# EAGLE schematic arduino board (EAGLE 6.1)

## Sheet 1 of 3: ANALOG COMMAND
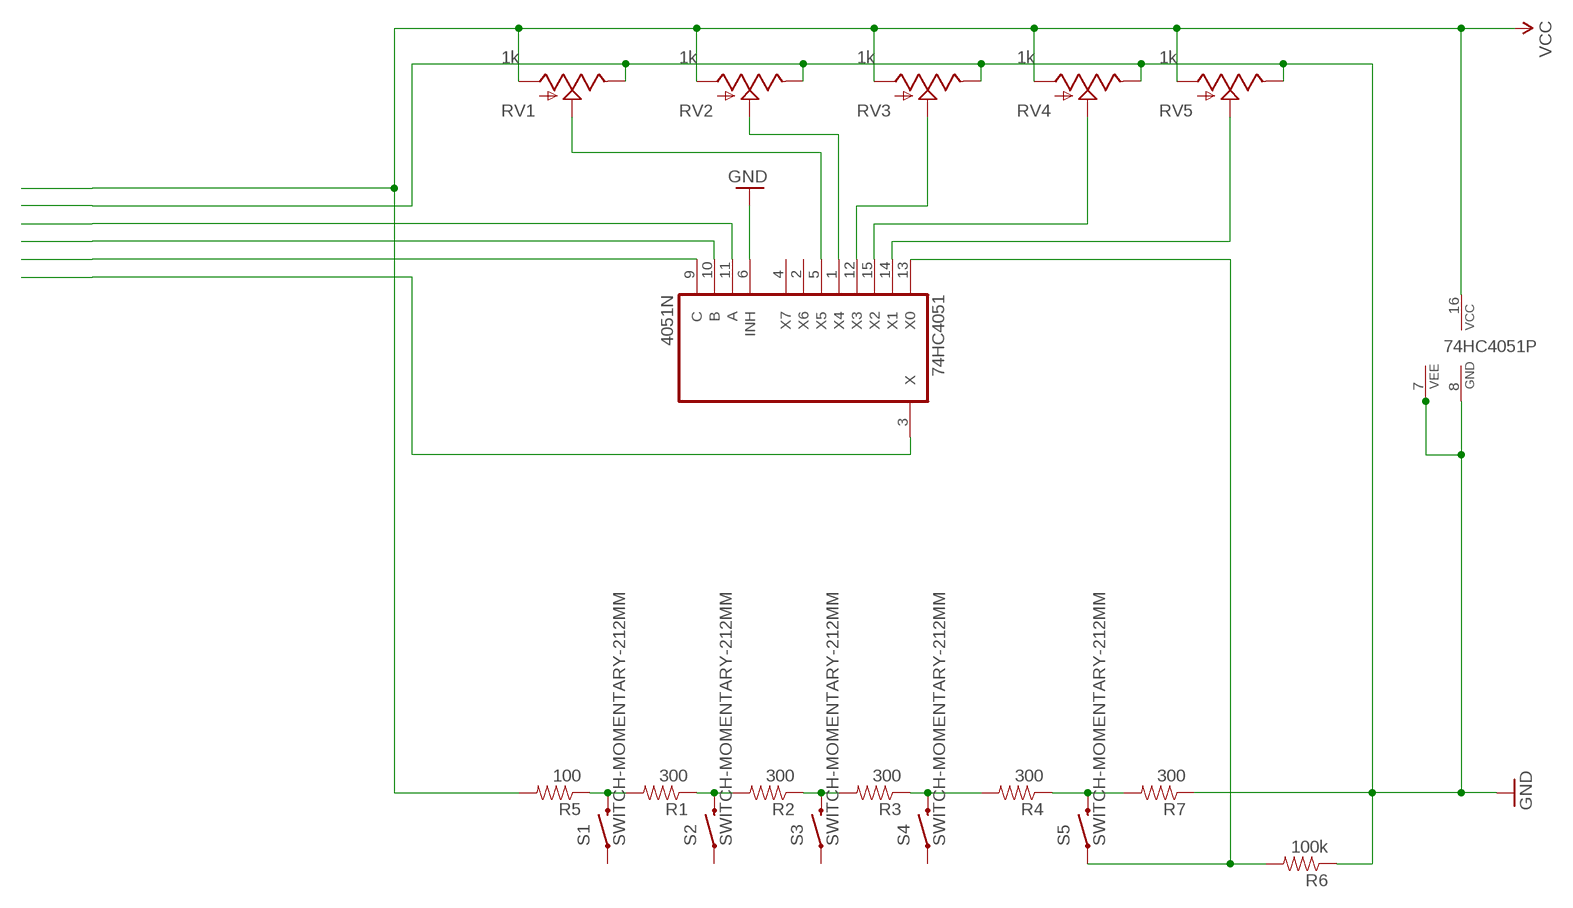
[diagram p0: schematic, sheet 1]

### Parts
74HC4051  4051N  [DIL16]
R1  300  RESISTORPTH-1/2W  [AXIAL-0.5]
R2  300  RESISTORPTH-1/2W  [AXIAL-0.5]
R3  300  RESISTORPTH-1/2W  [AXIAL-0.5]
R4  300  RESISTORPTH-1/2W  [AXIAL-0.5]
R5  100  RESISTORPTH-1/2W  [AXIAL-0.5]
R6  100k  RESISTORPTH-1/2W  [AXIAL-0.5]
R7  300  RESISTORPTH-1/2W  [AXIAL-0.5]
RV1  1k  POT  [ALPS_POT]
RV2  1k  POT  [ALPS_POT]
RV3  1k  POT  [ALPS_POT]
RV4  1k  POT  [ALPS_POT]
RV5  1k  POT  [ALPS_POT]
S1  SWITCH-MOMENTARY-212MM  [TACTILE-PTH-12MM]
S2  SWITCH-MOMENTARY-212MM  [TACTILE-PTH-12MM]
S3  SWITCH-MOMENTARY-212MM  [TACTILE-PTH-12MM]
S4  SWITCH-MOMENTARY-212MM  [TACTILE-PTH-12MM]
S5  SWITCH-MOMENTARY-212MM  [TACTILE-PTH-12MM]

### Nets
A1: 74HC4051.3(X) ; also sheet 2
D4_A_S0: 74HC4051.11(A) ; also sheet 2
D5_B_S1: 74HC4051.10(B) ; also sheet 2
D6_C_S2: 74HC4051.9(C) ; also sheet 2
GND: 74HC4051.6(INH) 74HC4051.7(VEE) 74HC4051.8(GND) R6.P$1 R7.P$1 RV1.P$1(E) RV2.P$1(E) RV3.P$1(E) RV4.P$1(E) RV5.P$1(E) ; also sheet 2
N$2: R1.P$2 R5.P$1 S1.3
N$3: R1.P$1 R2.P$2 S2.3
N$4: R2.P$1 R3.P$2 S3.3
N$5: R3.P$1 R4.P$2 S4.3
N$6: R4.P$1 R7.P$2 S5.3
POT1: 74HC4051.5(X5) RV1.P$2(S)
POT2: 74HC4051.1(X4) RV2.P$2(S)
POT3: 74HC4051.12(X3) RV3.P$2(S)
POT4: 74HC4051.15(X2) RV4.P$2(S)
POT5: 74HC4051.14(X1) RV5.P$2(S)
SWITCH_IN: 74HC4051.13(X0) R6.P$2 S5.1
VCC: 74HC4051.16(VCC) R5.P$2 RV1.P$3(A) RV2.P$3(A) RV3.P$3(A) RV4.P$3(A) RV5.P$3(A) ; also sheet 2
Unconnected: 74HC4051.2(X6) 74HC4051.4(X7) S1.1 S2.1 S3.1 S4.1

## Sheet 2 of 3: ANALOG IN CMD
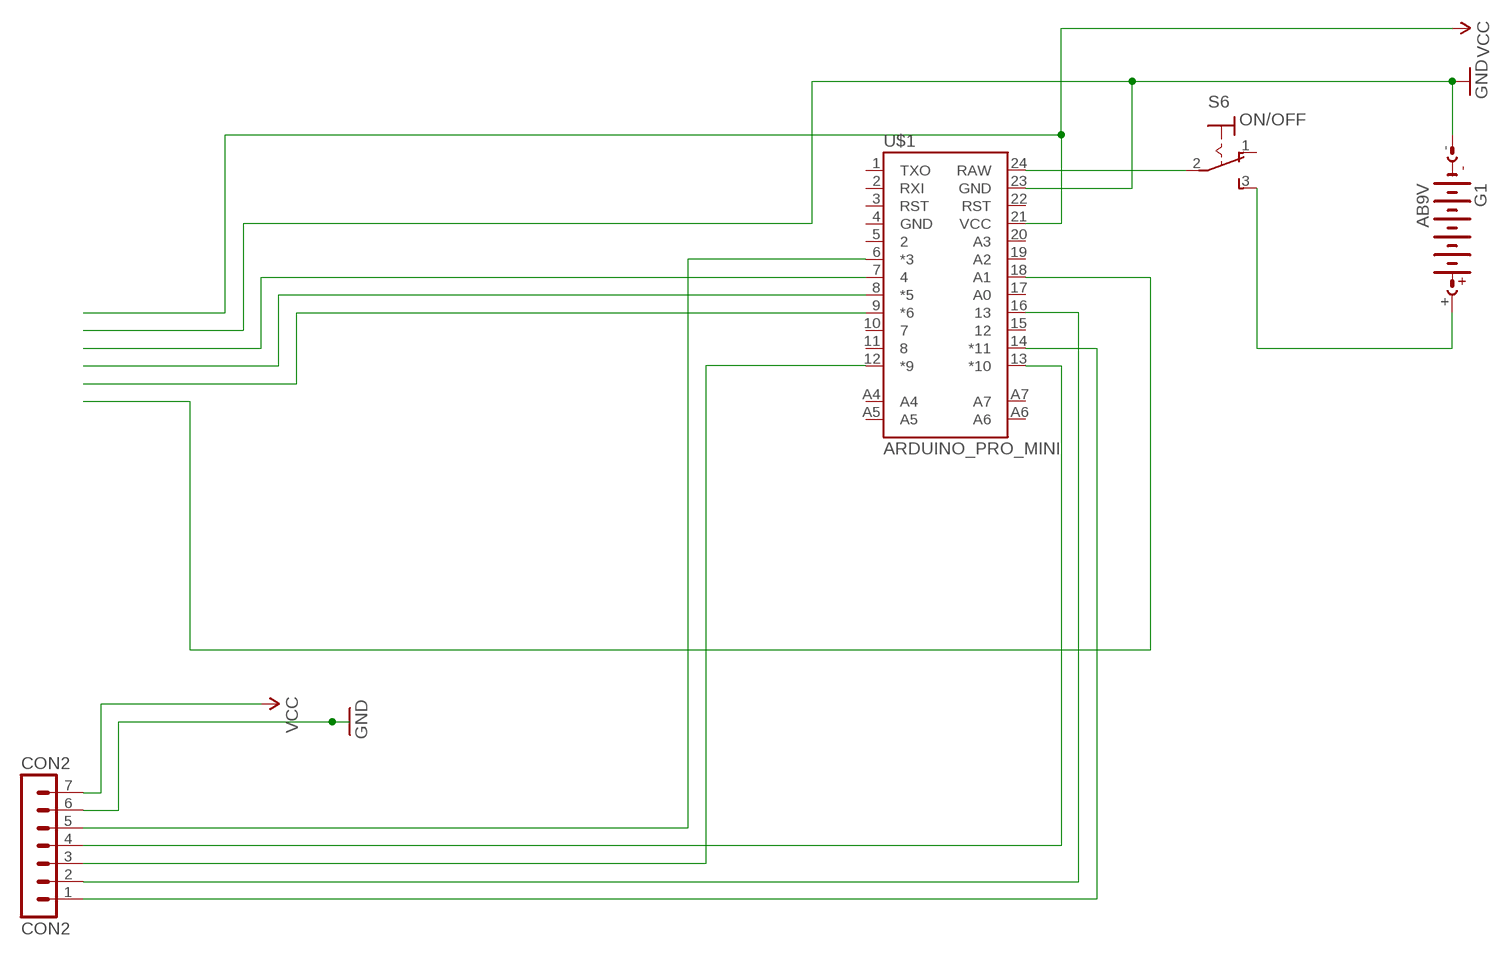
[diagram p1: schematic, sheet 2]

### Parts
CON2  CON2  MA07-1  [MA07-1]
G1  AB9V  [AB9V]
S6  ON/OFF  320-916  [320-916]
U$1  ARDUINO_PRO_MINI  [ARDUINO_PRO_MINI]

### Nets
A1: U$1.18(A1) ; also sheet 1
D3_GSCLK: CON2.5 U$1.6(*3)
D4_A_S0: U$1.7 ; also sheet 1
D5_B_S1: U$1.8(*5) ; also sheet 1
D6_C_S2: U$1.9(*6) ; also sheet 1
D9_XLAT: CON2.3 U$1.12(*9)
D10_BLANK: CON2.4 U$1.13(*10)
D11_SIN: CON2.1 U$1.14(*11)
D13_SCLK: CON2.2 U$1.16
GND: CON2.6 G1.- U$1.23(GND) ; also sheet 1
N$1: S6.2(P) U$1.24(RAW)
N$7: G1.+ S6.3(S)
VCC: CON2.7 U$1.21(VCC) ; also sheet 1
Unconnected: S6.1(O) U$1.1(TXO) U$1.2(RXI) U$1.3(RST) U$1.4(GND) U$1.5 U$1.10 U$1.11 U$1.15 U$1.17(A0) U$1.19(A2) U$1.20(A3) U$1.22(RST) U$1.A4 U$1.A5 U$1.A6 U$1.A7

## Sheet 3 of 3: LCD

## Library data of the parts
74HC4051 = 40xx:4051: 8-channel ANALOG MULTIPLEXER
CON2 = con-lstb:MA07-1: PIN HEADER; OC_FARNELL: unknown; OC_NEWARK: unknown
G1 = battery:AB9V: 9-V BATTERY CLIP
R1-R7 = SparkFun-Passives:RESISTOR: Resistor Basic schematic elements and footprints for 0603, 1206, and PTH resistors.
RV1-RV5 = SparkFun-Electromechanical:POT; PROD_ID: RES-09177
S1-S5 = SparkFun-Electromechanical:SWITCH-MOMENTARY-2: Various NO switches- pushbuttons, reed, etc; PROD_ID: SWCH-09185
S6 = switch:320-916: TOGGLE SWITCH distributor RS Components
U$1 = SparkFun-Boards:ARDUINO_PRO_MINI